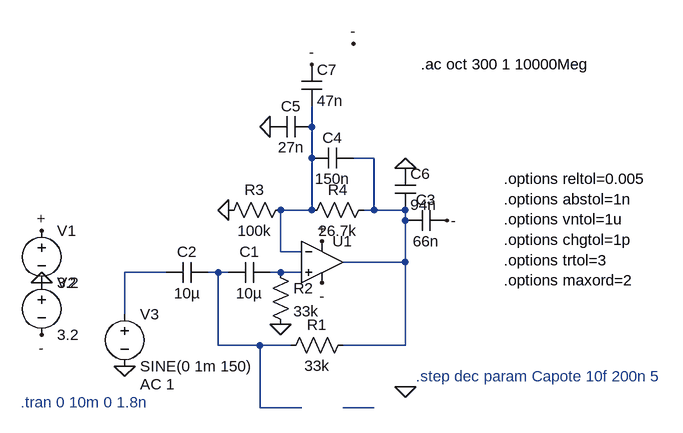
[diagram p0: schematic Amplificador_HPF_ConCapacitanciaParasita.asc]
Amplificador_HPF_ConCapacitanciaParasita.asc, the LTspice schematic file:
Version 4.1
SHEET 1 880 680
WIRE 112 -48 112 -80
WIRE 112 0 112 -48
WIRE 208 0 176 0
WIRE 112 80 112 0
WIRE 112 80 64 80
WIRE 208 80 208 0
WIRE 208 80 192 80
WIRE 256 80 208 80
WIRE 256 96 256 80
WIRE 64 144 64 80
WIRE 96 144 64 144
WIRE 256 160 256 96
WIRE 256 160 160 160
WIRE -112 176 -176 176
WIRE -32 176 -48 176
WIRE -16 176 -32 176
WIRE 64 176 48 176
WIRE 96 176 64 176
WIRE -176 240 -176 176
WIRE -32 288 -32 176
WIRE 32 288 -32 288
WIRE 80 288 32 288
WIRE 256 288 256 160
WIRE 256 288 160 288
WIRE 32 384 32 288
WIRE 96 384 32 384
WIRE 208 384 160 384
FLAG -304 192 0
FLAG -304 112 +
FLAG 128 128 +
FLAG -304 272 -
FLAG 128 192 -
FLAG 64 256 0
FLAG 256 352 0
FLAG -176 320 0
FLAG -16 80 0
FLAG 112 -144 -
FLAG 320 96 -
FLAG 48 -48 0
FLAG 256 16 0
FLAG 176 -176 -
SYMBOL voltage -304 96 R0
WINDOW 123 0 0 Left 0
WINDOW 39 0 0 Left 0
SYMATTR InstName V1
SYMATTR Value 3.2
SYMBOL voltage -304 176 R0
WINDOW 123 0 0 Left 0
WINDOW 39 0 0 Left 0
SYMATTR InstName V2
SYMATTR Value 3.2
SYMBOL res 176 272 R90
WINDOW 0 0 56 VBottom 2
WINDOW 3 32 56 VTop 2
SYMATTR InstName R1
SYMATTR Value 33k
SYMBOL cap 48 160 R90
WINDOW 0 0 32 VBottom 2
WINDOW 3 32 32 VTop 2
SYMATTR InstName C1
SYMATTR Value 10µ
SYMBOL cap -48 160 R90
WINDOW 0 0 32 VBottom 2
WINDOW 3 32 32 VTop 2
SYMATTR InstName C2
SYMATTR Value 10µ
SYMBOL res 48 160 R0
SYMATTR InstName R2
SYMATTR Value 33k
SYMBOL voltage -176 224 R0
WINDOW 123 24 124 Left 2
WINDOW 39 0 0 Left 0
SYMATTR InstName V3
SYMATTR Value SINE(0 1m 150)
SYMATTR Value2 AC 1
SYMBOL lib\\sym\\ZZZ\\OpAmps\\UniversalOpamp2 128 160 R0
SYMATTR InstName U1
SYMATTR Value2 Avol=10Meg GBW=14Meg Slew=40Meg
SYMATTR SpiceLine Ilimit=40m Rail=0 Vos=0
SYMBOL res 80 64 R90
WINDOW 0 0 56 VBottom 2
WINDOW 3 32 56 VTop 2
SYMATTR InstName R3
SYMATTR Value 100k
SYMBOL res 208 64 R90
WINDOW 0 0 56 VBottom 2
WINDOW 3 32 56 VTop 2
SYMATTR InstName R4
SYMATTR Value 26.7k
SYMBOL cap 320 80 R90
WINDOW 0 0 32 VBottom 2
WINDOW 3 32 32 VTop 2
SYMATTR InstName C3
SYMATTR Value 66n
SYMBOL cap 112 -64 R90
WINDOW 0 0 32 VBottom 2
WINDOW 3 32 32 VTop 2
SYMATTR InstName C5
SYMATTR Value 27n
SYMBOL cap 240 16 R0
SYMATTR InstName C6
SYMATTR Value 94n
SYMBOL cap 96 -144 R0
SYMATTR InstName C7
SYMATTR Value 47n
SYMBOL cap 176 -16 R90
WINDOW 0 0 32 VBottom 2
WINDOW 3 32 32 VTop 2
SYMATTR InstName C4
SYMATTR Value 150n
TEXT -336 376 Left 2 ;.tran 0 10m 0 1.8n
TEXT 408 32 Left 2 !.options reltol=0.005\n.options abstol=1n\n.options vntol=1u\n.options chgtol=1p\n.options trtol=3\n.options maxord=2
TEXT 280 -144 Left 2 !.ac oct 300 1 10000Meg
TEXT 272 336 Left 2 ;.step dec param Capote 10f 200n 5

The netlist it stands for:
* Amplificador_HPF_ConCapacitanciaParasita.asc
V1 + 0 3.2
V2 0 - 3.2
R1 N002 N004 33k
C1 N005 N004 10µ
C2 N004 N003 10µ
R2 N005 0 33k
V3 N003 0 SINE(0 1m 150) AC 1
X§U1 N005 N001 + - N002 level.2 Avol=10Meg GBW=14Meg Slew=40Meg Ilimit=40m Rail=0 Vos=0 en=0 enk=0 in=0 ink=0 Rin=500Meg  ; pins IN+ IN- V+ V- OUT
R3 N001 0 100k
R4 N002 N001 26.7k
C3 - N002 66n
C5 N001 0 27n
C6 0 N002 94n
C7 - N001 47n
C4 N002 N001 150n
* .tran 0 10m 0 1.8n
.options reltol=0.005
.options abstol=1n
.options vntol=1u
.options chgtol=1p
.options trtol=3
.options maxord=2
.ac oct 300 1 10000Meg
* .step dec param Capote 10f 200n 5
.lib UniversalOpamps2.sub
.backanno
.end